# EAGLE design UART_to_RS232 (EAGLE 7.2.0)
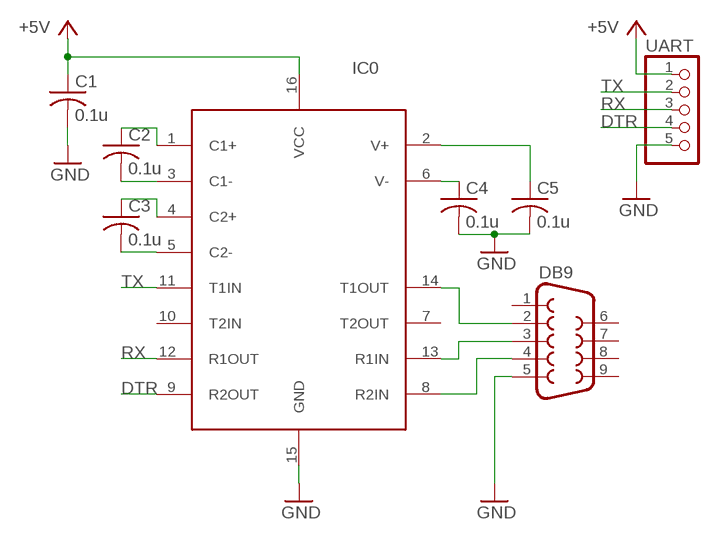
[diagram p0: schematic, sheet 1]

## Parts
C1  0.1u  C-USC0805K  [C0805K]
C2  0.1u  C-USC0805K  [C0805K]
C3  0.1u  C-USC0805K  [C0805K]
C4  0.1u  C-USC0805K  [C0805K]
C5  0.1u  C-USC0805K  [C0805K]
DB9  F09HP  [F09HP]
IC0  ICL3232  [SO16]
UART  PINHD-1X5  [1X05]

## Nets
+5V: C1.1 IC0.16(VCC) UART.1
DTR: IC0.9(R2OUT) UART.4
GND: C1.2 C4.2 C5.2 DB9.5 IC0.15(GND) UART.5
N$5: C3.2 IC0.5(C2-)
N$6: C3.1 IC0.4(C2+)
N$7: C2.1 IC0.1(C1+)
N$8: C2.2 IC0.3(C1-)
N$9: C5.1 IC0.2(V+)
N$10: C4.1 IC0.6(V-)
N$11: DB9.2 IC0.14(T1OUT)
N$12: DB9.3 IC0.13(R1IN)
N$13: DB9.4 IC0.8(R2IN)
RX: IC0.12(R1OUT) UART.3
TX: IC0.11(T1IN) UART.2
Unconnected: DB9.1 DB9.6 DB9.7 DB9.8 DB9.9 IC0.7(T2OUT) IC0.10(T2IN)

## Library data of the parts
C1-C5 = resistor:C-US: CAPACITOR, American symbol
DB9 = parts:F09: SUB-D; OC_FARNELL: unknown; OC_NEWARK: unknown
IC0 = parts:ICL3232
UART = pinhead:PINHD-1X5: PIN HEADER

## Board
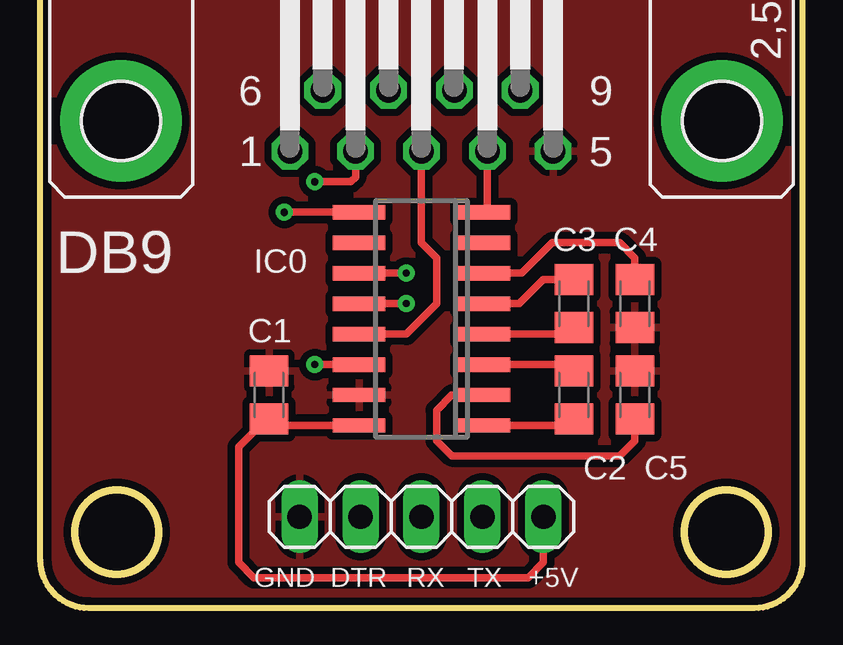
[diagram p1: board, top side]
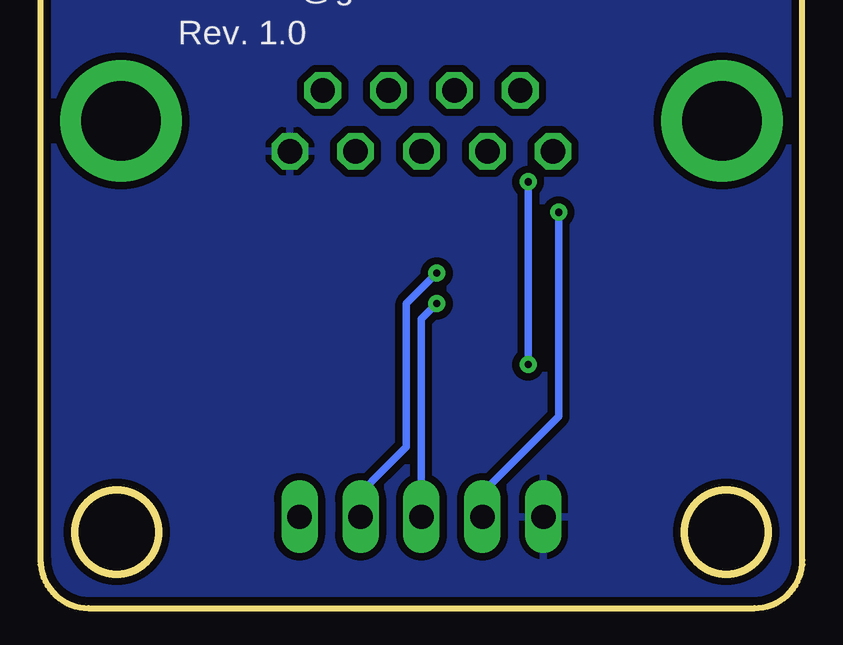
[diagram p2: board, bottom side, seen from below]

No outline drawn. Coordinates in mm, seen from the top.
Copper layers (1*16): Top 0.035mm / dielectric 1.5mm / Bottom 0.035mm
Design rules "default *": minimum track width 10mil, minimum drill 24mil, track to track 8mil, track to pad 8mil, pad to pad 8mil, via to via 8mil, smd to smd 8mil, copper to edge 40mil, drill to drill 8mil, minimum pad ring 10mil, minimum via ring 8mil, stop-mask expansion 4mil, vias tented up to drill 0.5mm, thermal gap 10mil
tRestrict: area -14.4,-10.6 to -10.9,-7.1; area 10.9,-10.6 to 14.4,-7.1; 6 lines
bRestrict: area -14.4,-10.6 to -10.9,-7.1; area 10.9,-10.6 to 14.4,-7.1; 6 lines
Milling: area -14.4,-10.6 to -10.9,-7.1; area 10.9,-10.6 to 14.4,-7.1; 6 lines

### Footprints (pad centres in the part's own frame; a part is rotated, then mirrored left to right if it is on the bottom)
C0805K = smd 1.3 x 1.6: 1 -1,0; 2 1,0
F09HP = drill 1.016 octagon: 1 -5.486,-1.27; 2 -2.743,-1.27; 3 0,-1.27; 4 2.743,-1.27; 5 5.486,-1.27; 6 -4.115,1.27; 7 -1.372,1.27; 8 1.372,1.27; 9 4.115,1.27 | drill 3.302 pad 5.08: G1 -12.522,0; G2 12.522,0
SO16 = smd 0.6 x 2.2: 1 -4.445,-2.6; 2 -3.175,-2.6; 3 -1.905,-2.6; 4 -0.635,-2.6; 5 0.635,-2.6; 6 1.905,-2.6; 7 3.175,-2.6; 8 4.445,-2.6; 9 4.445,2.6; 10 3.175,2.6; 11 1.905,2.6; 12 0.635,2.6; 13 -0.635,2.6; 14 -1.905,2.6; 15 -3.175,2.6; 16 -4.445,2.6
1X05 = drill 1.016 long: 1 -5.08,0; 2 -2.54,0; 3 0,0; 4 2.54,0; 5 5.08,0

### Placement (x,y rotation side)
C1  -6.35,-3.17 90 top
C2  6.35,-3.17 90 top
C3  6.35,0.64 90 top
C4  8.89,0.64 270 top
C5  8.89,-3.17 90 top
DB9  0,8.26 0 top
IC0  0,0 90 top
UART  0,-8.26 180 top

### Tracks (layer width: path | path; a pad name or v marks a point on that pad's centre or on a via)
+5V
  Top 0.305: IC0.16 -6.35,-4.45 | UART.1 5.08,-10.16 4.45,-10.79 -6.99,-10.79 -7.62,-10.16 -7.62,-5.34 -6.72,-4.45 -6.35,-4.45 | -6.35,-4.45 C1.1
DTR  (via drill 0.3)
  Top 0.305: v-5.71,4.45 IC0.9
  Bottom 0.305: v-5.71,4.45 -5.71,-4.07 -3.44,-6.35 -2.54,-7.25 UART.4
GND
  pour Bottom (isolate 0.305): -17.78,21.59 -17.78,-13.97 17.78,-13.97 17.78,21.59
  pour Top (isolate 0.305): -17.78,21.59 -17.78,-13.97 17.78,-13.97 17.78,21.59
N$5
  Top 0.305: IC0.5 4.08,0.64 5.08,1.64 C3.2
N$6
  Top 0.305: IC0.4 6.35,-0.64 C3.1
N$7
  Top 0.305: IC0.1 6.35,-4.45 C2.1
N$8
  Top 0.305: IC0.3 6.35,-1.91 C2.2
N$9
  Top 0.305: IC0.2 1.27,-3.17 0.64,-3.81 0.64,-5.08 1.27,-5.71 8.26,-5.71 8.89,-5.08 C5.1
N$10
  Top 0.305: IC0.6 4.18,1.91 5.08,2.8 5.45,3.17 8.26,3.17 8.89,2.54 C4.1
N$11  (via drill 0.3)
  Top 0.305: v-4.45,-1.91 IC0.14 | DB9.2 -2.74,5.92 -2.95,5.71 v-4.45,5.71
  Bottom 0.305: v-4.45,5.71 v-4.45,-1.91
N$12
  Top 0.305: DB9.3 0,3.17 0.64,2.54 0.64,0.64 0,0 -0.64,-0.64 IC0.13
N$13
  Top 0.305: DB9.4 2.74,4.45 IC0.8
RX  (via drill 0.3)
  Top 0.305: v-0.64,0.64 IC0.12
  Bottom 0.305: UART.3 0,0 v-0.64,0.64
TX  (via drill 0.3)
  Top 0.305: v-0.64,1.91 IC0.11
  Bottom 0.305: UART.2 2.54,-7.25 1.64,-6.35 0.64,-5.34 0.64,0.64 v-0.64,1.91

### Text on the board
tPlace: GND | DTR | RX | TX | +5V
bNames: UART_to_RS232 | ccbruce@gmail.com | Rev. 1.0